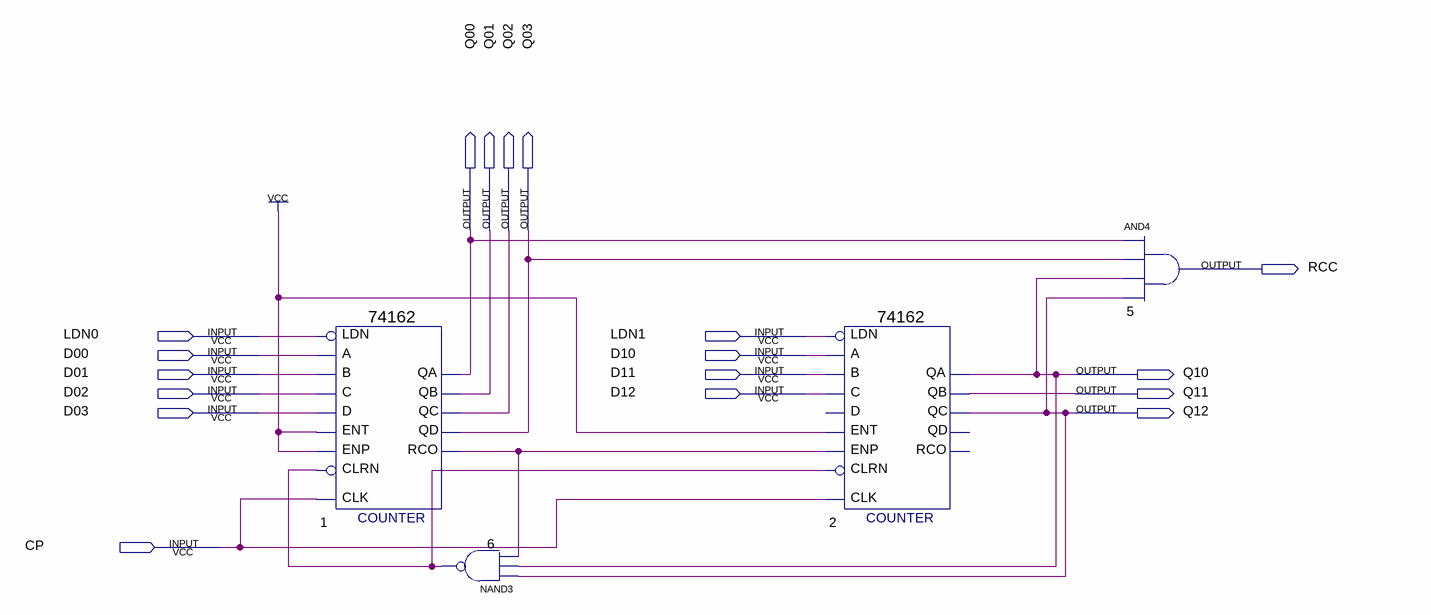
[diagram p0: schematic sheet]
// Quartus schematic 60Counter.bdf as structural Verilog: 4 symbols, 18 pins
module \60Counter  (
  input  LDN0,
  input  LDN1,
  input  D00,
  input  D10,
  input  D01,
  input  D11,
  input  D02,
  input  D12,
  input  D03,
  input  CP,
  output Q00,
  output Q01,
  output Q02,
  output Q03,
  output RCC,
  output Q10,
  output Q11,
  output Q12
);

  wire n1_rco, n6_out;

  \74162  u_1 (
    .A(D00), .LDN(LDN0), .B(D01), .C(D02), .D(D03), .ENP(1'b1), .ENT(1'b1), .CLRN(n6_out), .CLK(CP),
    .QA(Q00), .QB(Q01), .QC(Q02), .QD(Q03), .RCO(n1_rco));
  nand u_6 (n6_out, Q12, Q10, n1_rco);
  \74162  u_2 (
    .A(D10), .LDN(LDN1), .B(D11), .C(D12), .ENP(n1_rco), .ENT(1'b1), .CLRN(n6_out), .CLK(CP), .QA(Q10),
    .QB(Q11), .QC(Q12));  // open: D, QD, RCO
  and u_5 (RCC, Q00, Q03, Q10, Q12);
endmodule
